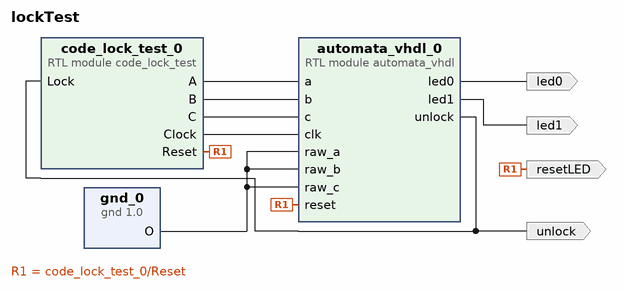
[diagram p0: block diagram of the top level]
# Vivado block design lockTest, xc7a35tcpg236-1, Vivado 2018.3
create_bd_design lockTest

create_bd_port -dir O led0
create_bd_port -dir O led1
create_bd_port -dir O unlock
create_bd_port -dir O resetLED

create_bd_cell -type ip -vlnv FIT:user:gnd:1.0 gnd_0
create_bd_cell -type module -reference code_lock_test code_lock_test_0
set_property -dict [list \
  CONFIG.C_CODE ACAB \
  CONFIG.C_FSM_TYPE MEALY \
  CONFIG.C_TEST1 AACABCCA \
  CONFIG.C_TEST2 BACABACA \
  CONFIG.C_TEST3 NNACBACABA \
] [get_bd_cells code_lock_test_0]
create_bd_cell -type module -reference automata_vhdl automata_vhdl_0

# ---- connections ----

connect_bd_net [get_bd_pins code_lock_test_0/Reset] [get_bd_ports resetLED] [get_bd_pins automata_vhdl_0/reset]
connect_bd_net [get_bd_pins code_lock_test_0/A] [get_bd_pins automata_vhdl_0/a]
connect_bd_net [get_bd_pins code_lock_test_0/B] [get_bd_pins automata_vhdl_0/b]
connect_bd_net [get_bd_pins code_lock_test_0/C] [get_bd_pins automata_vhdl_0/c]
connect_bd_net [get_bd_pins code_lock_test_0/Clock] [get_bd_pins automata_vhdl_0/clk]
connect_bd_net [get_bd_pins gnd_0/O] [get_bd_pins automata_vhdl_0/raw_a] [get_bd_pins automata_vhdl_0/raw_b] [get_bd_pins automata_vhdl_0/raw_c]
connect_bd_net [get_bd_pins automata_vhdl_0/unlock] [get_bd_ports unlock] [get_bd_pins code_lock_test_0/Lock]
connect_bd_net [get_bd_pins automata_vhdl_0/led0] [get_bd_ports led0]
connect_bd_net [get_bd_pins automata_vhdl_0/led1] [get_bd_ports led1]

validate_bd_design
save_bd_design
